# EAGLE schematic voodoo_dido (EAGLE 7.7.0)
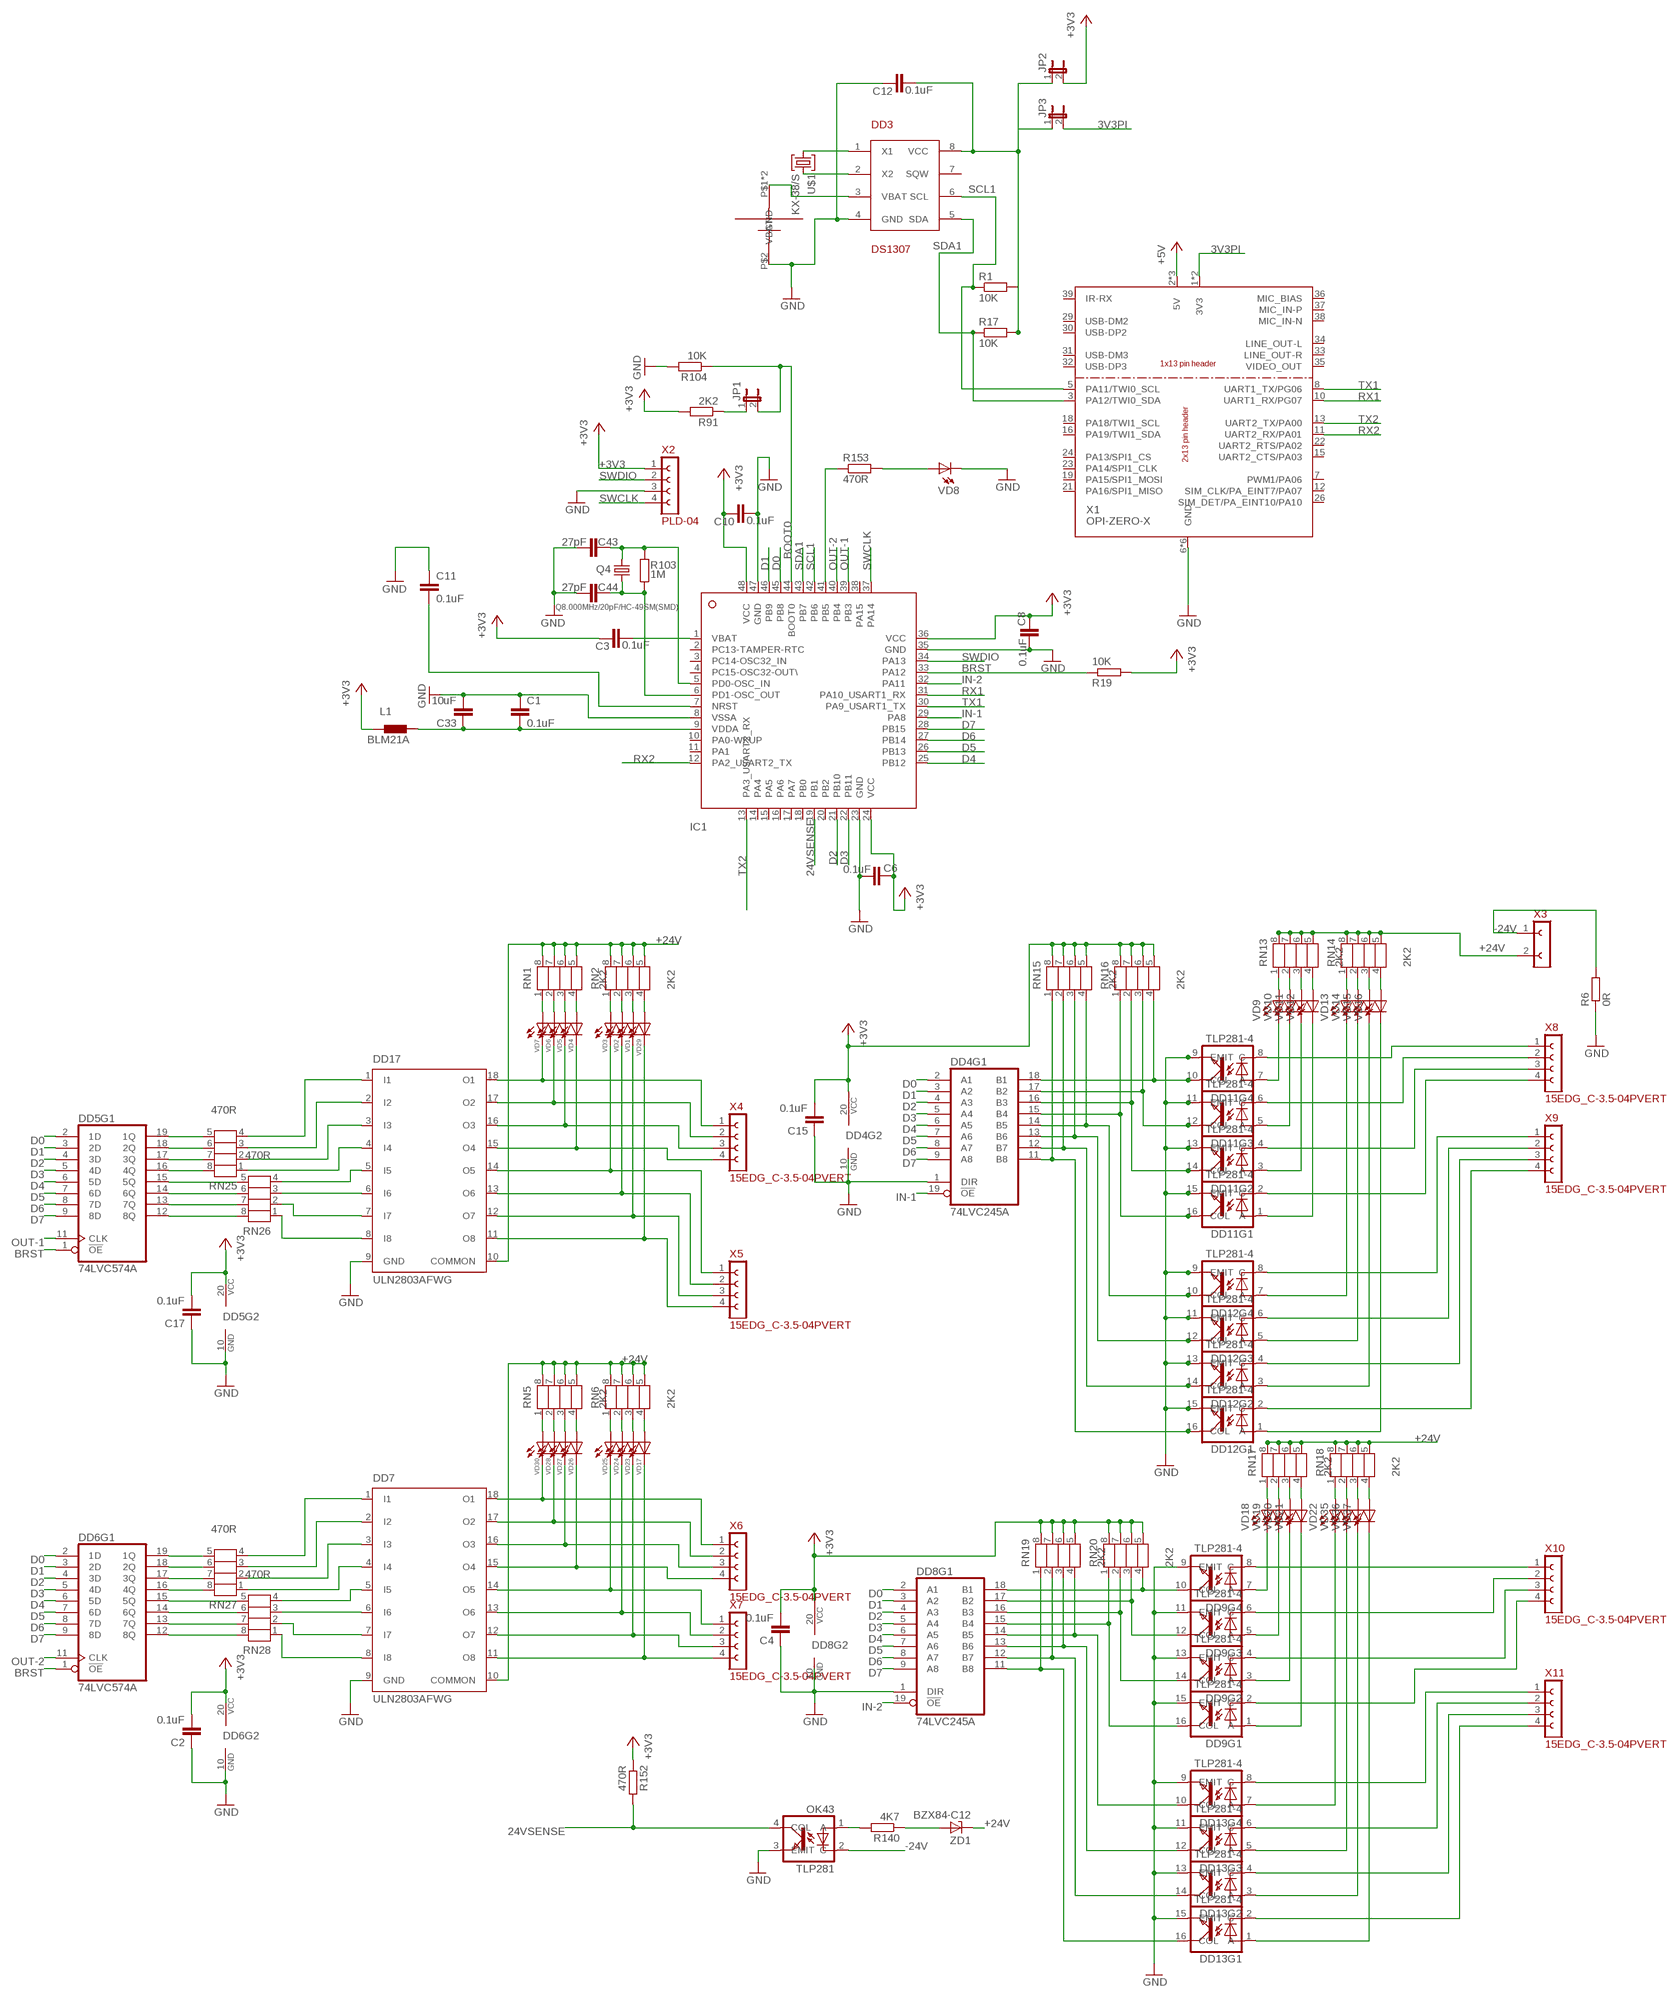
[diagram p0: schematic, sheet 1, part 1 of 2]
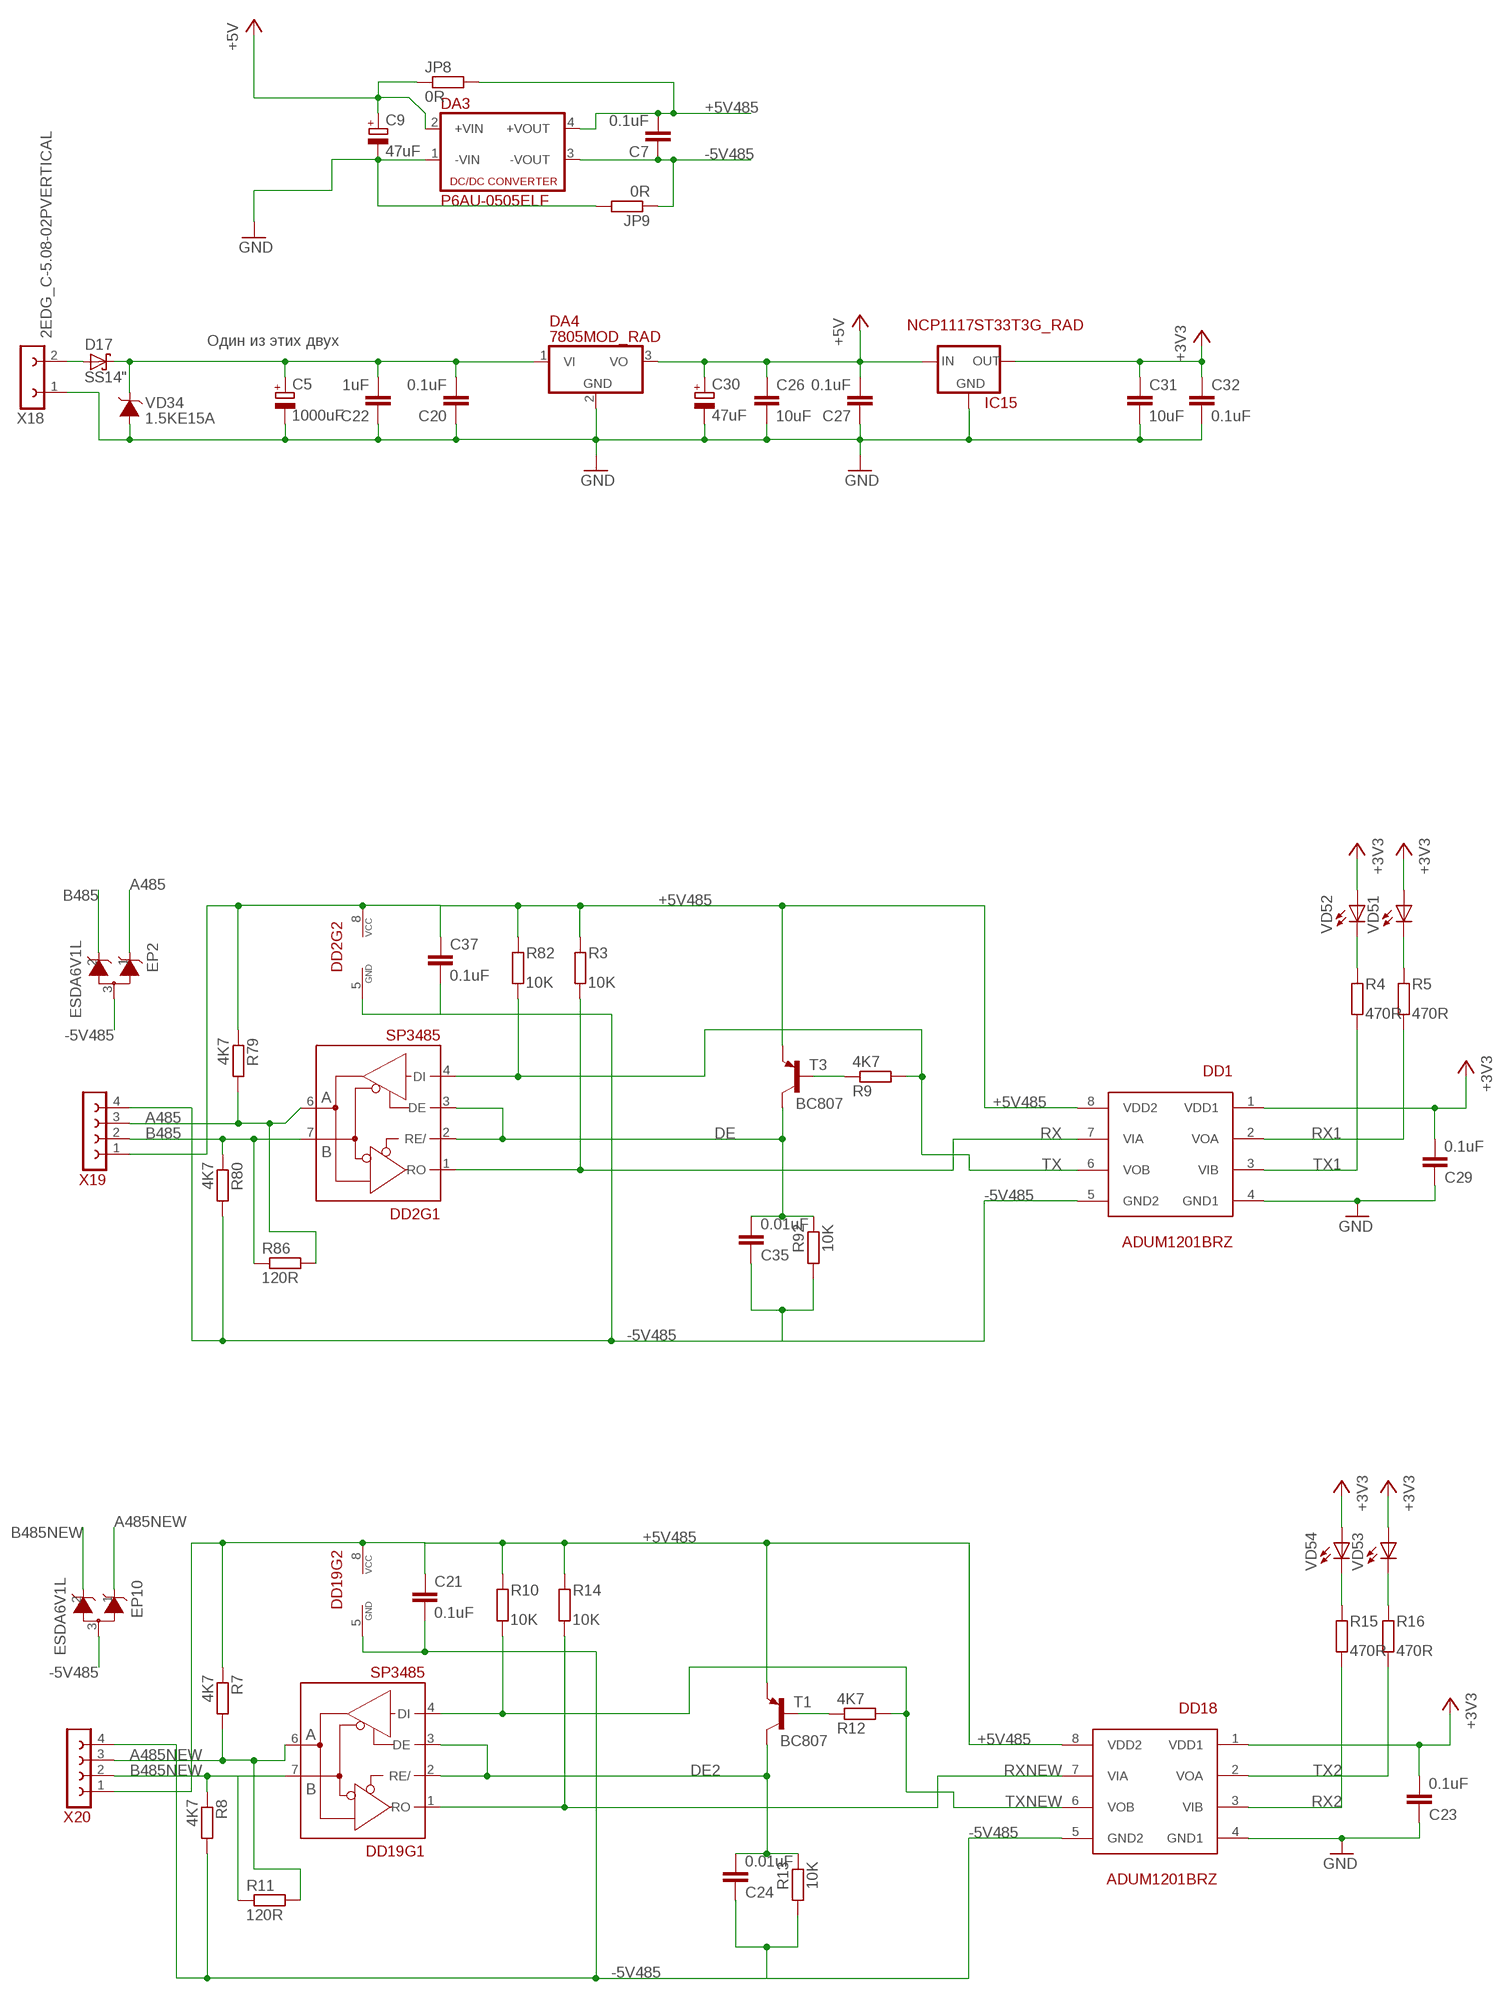
[diagram p1: schematic, sheet 1, part 2 of 2]

## Parts
B1  BH840  [BH840]
C1  0.1uF  CAP0603MOD  [0603MOD]
C2  0.1uF  CAP0805MOD  [0805MOD]
C3  0.1uF  CAP0603MOD  [0603MOD]
C4  0.1uF  CAP0805MOD  [0805MOD]
C5  1000uF  CPOL-EU150CLZ-1010  [150CLZ-1010]
C6  0.1uF  CAP0603MOD  [0603MOD]
C7  0.1uF  CAP0805MOD  [0805MOD]
C8  0.1uF  CAP0603MOD  [0603MOD]
C9  47uF  CPOL-EUSMCB  [SMC_B]
C10  0.1uF  CAP0603MOD  [0603MOD]
C11  0.1uF  CAP0603MOD  [0603MOD]
C12  0.1uF  CAP0603MOD  [0603MOD]
C15  0.1uF  CAP0805MOD  [0805MOD]
C17  0.1uF  CAP0805MOD  [0805MOD]
C20  0.1uF  CAP0805MOD  [0805MOD]
C21  0.1uF  CAP0805MOD  [0805MOD]
C22  1uF  CAP0805MOD  [0805MOD]
C23  0.1uF  CAP0805MOD  [0805MOD]
C24  0.01uF  CAP0805MOD  [0805MOD]
C26  10uF  C-EUC1206  [C1206]
C27  0.1uF  CAP0805MOD  [0805MOD]
C29  0.1uF  CAP0805MOD  [0805MOD]
C30  47uF  CPOL-EUSMCB  [SMC_B]
C31  10uF  C-EUC1206  [C1206]
C32  0.1uF  CAP0805MOD  [0805MOD]
C33  10uF  C-EUC1206  [C1206]
C35  0.01uF  CAP0805MOD  [0805MOD]
C37  0.1uF  CAP0805MOD  [0805MOD]
C43  27pF  CAP0805MOD  [0805MOD]
C44  27pF  CAP0805MOD  [0805MOD]
D17  SS14"  [MLL-41]
DA3  P6AU-0505ELF  [SIP4]
DA4  7805MOD_RAD  [TO220RAD]
DD1  ADUM1201BRZ  [SO08]
DD2  SP3485  [SO08]
DD3  DS1307  [SO08]
DD4  74LVC245A  [SO20W]
DD5  74LVC574A  [SO20W]
DD6  74LVC574A  [SO20W]
DD7  ULN2803AFWG  [SO18]
DD8  74LVC245A  [SO20W]
DD9  TLP281-4  [TLP281-4]
DD11  TLP281-4  [TLP281-4]
DD12  TLP281-4  [TLP281-4]
DD13  TLP281-4  [TLP281-4]
DD17  ULN2803AFWG  [SO18]
DD18  ADUM1201BRZ  [SO08]
DD19  SP3485  [SO08]
EP2  ESDA6V1L  [SOT23]
EP10  ESDA6V1L  [SOT23]
IC1  STM32F103C8T6  [TQFP48]
IC15  NCP1117ST33T3G_RAD  [SOT223_PCBRAD]
JP1  JP1E  [JP1]
JP2  JP1E  [JP1]
JP3  JP1E  [JP1]
JP8  0R  RES0805MOD  [0805MOD]
JP9  0R  RES0805MOD  [0805MOD]
L1  BLM21A  [1206/0603]
OK43  TLP281  [TLP281]
Q4  Q8.000MHz/20pF/HC-49SM(SMD)  CRYSTALHC49UP  [HC49UP]
R1  10K  RES0805MOD  [0805MOD]
R3  10K  RES0805MOD  [0805MOD]
R4  470R  RES0805MOD  [0805MOD]
R5  470R  RES0805MOD  [0805MOD]
R6  0R  RES0805MOD  [0805MOD]
R7  4K7  RES0805MOD  [0805MOD]
R8  4K7  RES0805MOD  [0805MOD]
R9  4K7  RES0805MOD  [0805MOD]
R10  10K  RES0805MOD  [0805MOD]
R11  120R  RES0805MOD  [0805MOD]
R12  4K7  RES0805MOD  [0805MOD]
R13  10K  RES0805MOD  [0805MOD]
R14  10K  RES0805MOD  [0805MOD]
R15  470R  RES0805MOD  [0805MOD]
R16  470R  RES0805MOD  [0805MOD]
R17  10K  RES0805MOD  [0805MOD]
R19  10K  RES0805MOD  [0805MOD]
R79  4K7  RES0805MOD  [0805MOD]
R80  4K7  RES0805MOD  [0805MOD]
R82  10K  RES0805MOD  [0805MOD]
R86  120R  RES0805MOD  [0805MOD]
R91  2K2  RES0805MOD  [0805MOD]
R92  10K  RES0805MOD  [0805MOD]
R103  1M  RES0805MOD  [0805MOD]
R104  10K  RES0805MOD  [0805MOD]
R140  4K7  RES0805MOD  [0805MOD]
R152  470R  RES0805MOD  [0805MOD]
R153  470R  RES0805MOD  [0805MOD]
RN1  2K2  CAT16-J4  [CAT16-J4]
RN2  2K2  CAT16-J4  [CAT16-J4]
RN5  2K2  CAT16-J4  [CAT16-J4]
RN6  2K2  CAT16-J4  [CAT16-J4]
RN13  2K2  CAT16-J4  [CAT16-J4]
RN14  2K2  CAT16-J4  [CAT16-J4]
RN15  2K2  CAT16-J4  [CAT16-J4]
RN16  2K2  CAT16-J4  [CAT16-J4]
RN17  2K2  CAT16-J4  [CAT16-J4]
RN18  2K2  CAT16-J4  [CAT16-J4]
RN19  2K2  CAT16-J4  [CAT16-J4]
RN20  2K2  CAT16-J4  [CAT16-J4]
RN25  470R  CAT16-J4  [CAT16-J4]
RN26  470R  CAT16-J4  [CAT16-J4]
RN27  470R  CAT16-J4  [CAT16-J4]
RN28  470R  CAT16-J4  [CAT16-J4]
T1  BC807  BC807-16-PNP-SOT23-BEC  [SOT23-BEC]
T3  BC807  BC807-16-PNP-SOT23-BEC  [SOT23-BEC]
U$1  KX-38/S  [KX-38]
VD1  KP-2012EC(RED)  [CHIP-LED0805]
VD2  KP-2012EC(RED)  [CHIP-LED0805]
VD3  KP-2012EC(RED)  [CHIP-LED0805]
VD4  KP-2012EC(RED)  [CHIP-LED0805]
VD5  KP-2012EC(RED)  [CHIP-LED0805]
VD6  KP-2012EC(RED)  [CHIP-LED0805]
VD7  KP-2012EC(RED)  [CHIP-LED0805]
VD8  KP-2012SGC(GREEN)  [CHIP-LED0805]
VD9  KP-2012SGC(GREEN)  [CHIP-LED0805]
VD10  KP-2012SGC(GREEN)  [CHIP-LED0805]
VD11  KP-2012SGC(GREEN)  [CHIP-LED0805]
VD12  KP-2012SGC(GREEN)  [CHIP-LED0805]
VD13  KP-2012SGC(GREEN)  [CHIP-LED0805]
VD14  KP-2012SGC(GREEN)  [CHIP-LED0805]
VD15  KP-2012SGC(GREEN)  [CHIP-LED0805]
VD16  KP-2012SGC(GREEN)  [CHIP-LED0805]
VD17  KP-2012EC(RED)  [CHIP-LED0805]
VD18  KP-2012SGC(GREEN)  [CHIP-LED0805]
VD19  KP-2012SGC(GREEN)  [CHIP-LED0805]
VD20  KP-2012SGC(GREEN)  [CHIP-LED0805]
VD21  KP-2012SGC(GREEN)  [CHIP-LED0805]
VD22  KP-2012SGC(GREEN)  [CHIP-LED0805]
VD23  KP-2012EC(RED)  [CHIP-LED0805]
VD24  KP-2012EC(RED)  [CHIP-LED0805]
VD25  KP-2012EC(RED)  [CHIP-LED0805]
VD26  KP-2012EC(RED)  [CHIP-LED0805]
VD27  KP-2012EC(RED)  [CHIP-LED0805]
VD28  KP-2012EC(RED)  [CHIP-LED0805]
VD29  KP-2012EC(RED)  [CHIP-LED0805]
VD30  KP-2012EC(RED)  [CHIP-LED0805]
VD34  1.5KE15A  [MSORB_41A-04_D]
VD35  KP-2012SGC(GREEN)  [CHIP-LED0805]
VD36  KP-2012SGC(GREEN)  [CHIP-LED0805]
VD37  KP-2012SGC(GREEN)  [CHIP-LED0805]
VD51  KP-2012SGC(GREEN)  [CHIP-LED0805]
VD52  KP-2012SGC(GREEN)  [CHIP-LED0805]
VD53  KP-2012SGC(GREEN)  [CHIP-LED0805]
VD54  KP-2012SGC(GREEN)  [CHIP-LED0805]
X1  OPI-ZERO-X  [OPI0X]
X2  PLD-04  [PLD04]
X3  2EDG_C-5.08-02PVERTICAL  [2EDGVC-5.08-02P]
X4  15EDG_C-3.5-04PVERT  [15EDGVC-3.5-04P]
X5  15EDG_C-3.5-04PVERT  [15EDGVC-3.5-04P]
X6  15EDG_C-3.5-04PVERT  [15EDGVC-3.5-04P]
X7  15EDG_C-3.5-04PVERT  [15EDGVC-3.5-04P]
X8  15EDG_C-3.5-04PVERT  [15EDGVC-3.5-04P]
X9  15EDG_C-3.5-04PVERT  [15EDGVC-3.5-04P]
X10  15EDG_C-3.5-04PVERT  [15EDGVC-3.5-04P]
X11  15EDG_C-3.5-04PVERT  [15EDGVC-3.5-04P]
X18  2EDG_C-5.08-02PVERTICAL  [2EDGVC-5.08-02P]
X19  15EDG_C-3.5-04PVERT  [15EDGVC-3.5-04P]
X20  15EDG_C-3.5-04PVERT  [15EDGVC-3.5-04P]
ZD1  BZX84-C12  [SOT23]

## Nets
3V3PI: JP3.2 X1.1(3V3) X1.17(3V3)
24VSENSE: IC1.19(PB1) OK43.4(COL) R152.P$2
+3V3: C2.P$2 C3.1 C4.P$2 C6.1 C8.1 C10.1 C15.P$2 C17.P$2 C23.P$2 C29.P$2 C31.1 C32.P$1 DD1.1(VDD1) DD4.20(VCC) DD5.20(VCC) DD6.20(VCC) DD8.20(VCC) DD18.1(VDD1) IC1.24(VDD) IC1.36(VDD) IC1.48(VDD) IC15.2(OUT) JP2.2 L1.1 R19.P$2 R91.P$2 R152.P$1 RN15.5 RN15.6 RN15.7 RN15.8 RN16.5 RN16.6 RN16.7 RN16.8 RN19.5 RN19.6 RN19.7 RN19.8 RN20.5 RN20.6 RN20.7 RN20.8 VD51.A VD52.A VD53.A VD54.A X2.1
+5V: C9.+ C26.1 C27.P$2 C30.+ DA3.2(+VIN) DA4.3(VO) IC15.3(IN) JP8.P$1 X1.2(5V) X1.4(5V) X1.27(5V)
+5V485: C7.P$2 C21.P$1 C37.P$1 DA3.4(+VOUT) DD1.8(VDD2) DD2.8(VCC) DD18.8(VDD2) DD19.8(VCC) JP8.P$2 R3.P$1 R7.P$1 R10.P$1 R14.P$1 R79.P$1 R82.P$1 T1.E T3.E X19.1 X20.1
+24V: DD7.10(COMMON) DD17.10(COMMON) RN1.5 RN1.6 RN1.7 RN1.8 RN2.5 RN2.6 RN2.7 RN2.8 RN5.5 RN5.6 RN5.7 RN5.8 RN6.5 RN6.6 RN6.7 RN6.8 RN13.5 RN13.6 RN13.7 RN13.8 RN14.5 RN14.6 RN14.7 RN14.8 RN17.5 RN17.6 RN17.7 RN17.8 RN18.5 RN18.6 RN18.7 RN18.8 X3.2 ZD1.3(C)
-5V485: C7.P$1 C21.P$2 C24.P$1 C35.P$1 C37.P$2 DA3.3(-VOUT) DD1.5(GND2) DD2.5(GND) DD18.5(GND2) DD19.5(GND) EP2.3 EP10.3 JP9.P$1 R8.P$2 R13.P$2 R80.P$2 R92.P$2 X19.4 X20.4
-24V: OK43.2(C) R6.P$2 X3.1
A485: DD2.6(A) EP2.1 R79.P$2 R86.P$2 X19.3
A485NEW: DD19.6(A) EP10.1 R7.P$2 R11.P$2 X20.3
B485: DD2.7(B) EP2.2 R80.P$1 R86.P$1 X19.2
B485NEW: DD19.7(B) EP10.2 R8.P$1 R11.P$1 X20.2
BOOT0: IC1.44(BOOT0) JP1.2 R104.P$1
BRST: DD5.1(!OE) DD6.1(!OE) IC1.33(PA12) R19.P$1
D0: DD4.2(A1) DD5.2(1D) DD6.2(1D) DD8.2(A1) IC1.45(PB8)
D1: DD4.3(A2) DD5.3(2D) DD6.3(2D) DD8.3(A2) IC1.46(PB9)
D2: DD4.4(A3) DD5.4(3D) DD6.4(3D) DD8.4(A3) IC1.21(PB10)
D3: DD4.5(A4) DD5.5(4D) DD6.5(4D) DD8.5(A4) IC1.22(PB11)
D4: DD4.6(A5) DD5.6(5D) DD6.6(5D) DD8.6(A5) IC1.25(PB12)
D5: DD4.7(A6) DD5.7(6D) DD6.7(6D) DD8.7(A6) IC1.26(PB13)
D6: DD4.8(A7) DD5.8(7D) DD6.8(7D) DD8.8(A7) IC1.27(PB14)
D7: DD4.9(A8) DD5.9(8D) DD6.9(8D) DD8.9(A8) IC1.28(PB15)
DE: C35.P$2 DD2.2(RE/) DD2.3(DE) R92.P$1 T3.C
DE2: C24.P$2 DD19.2(RE/) DD19.3(DE) R13.P$1 T1.C
GND: B1.P$2(GND) C1.1 C2.P$1 C4.P$1 C5.- C6.2 C8.2 C9.- C10.2 C11.1 C12.1 C15.P$1 C17.P$1 C20.P$1 C22.P$1 C23.P$1 C26.2 C27.P$1 C29.P$1 C30.- C31.2 C32.P$2 C33.2 C43.P$2 C44.P$2 DA3.1(-VIN) DA4.2(GND) DD1.4(GND1) DD3.4(GND) DD4.1(DIR) DD4.10(GND) DD5.10(GND) DD6.10(GND) DD7.9(GND) DD8.1(DIR) DD8.10(GND) DD9.9(EMIT) DD9.11(EMIT) DD9.13(EMIT) DD9.15(EMIT) DD11.9(EMIT) DD11.11(EMIT) DD11.13(EMIT) DD11.15(EMIT) DD12.9(EMIT) DD12.11(EMIT) DD12.13(EMIT) DD12.15(EMIT) DD13.9(EMIT) DD13.11(EMIT) DD13.13(EMIT) DD13.15(EMIT) DD17.9(GND) DD18.4(GND1) IC1.8(VSSA) IC1.23(VSS) IC1.35(VSS) IC1.47(VSS) IC15.1(GND) JP9.P$2 OK43.3(EMIT) R6.P$1 R104.P$2 VD8.C VD34.A X1.6(GND) X1.9(GND) X1.14(GND) X1.20(GND) X1.25(GND) X1.28(GND) X2.3 X18.1
IN-1: DD4.19(!OE) IC1.29(PA8)
IN-2: DD8.19(!OE) IC1.32(PA11)
N$1: DD8.18(B1) DD9.10(COL) RN20.4
N$2: DD11.7(A) VD9.C
N$3: C5.+ C20.P$2 C22.P$2 D17.K(C) DA4.1(VI) VD34.С(C)
N$4: R4.P$1 VD52.C
N$5: R5.P$1 VD51.C
N$6: IC1.41(PB5) R153.P$1
N$7: DD8.17(B2) DD9.12(COL) RN20.3
N$8: C11.2 IC1.7(NRST)
N$9: DD8.16(B3) DD9.14(COL) RN20.2
N$10: D17.A X18.2
N$12: DD3.1(X1) U$1.1
N$13: DD8.15(B4) DD9.16(COL) RN20.1
N$14: DD9.7(A) VD18.C
N$15: DD9.5(A) VD19.C
N$16: DD3.2(X2) U$1.2
N$17: B1.P$1(VBAT) B1.P$3(VBAT) DD3.3(VBAT)
N$18: C12.2 DD3.8(VCC) JP2.1 JP3.1 R1.P$2 R17.P$2
N$19: C3.2 IC1.1(VBAT)
N$21: DD9.3(A) VD20.C
N$22: DD11.5(A) VD10.C
N$23: DD11.3(A) VD11.C
N$24: DD4.18(B1) DD11.10(COL) RN16.4
N$26: DD11.1(A) VD12.C
N$27: RN13.1 VD9.A
N$28: RN13.2 VD10.A
N$29: RN13.3 VD11.A
N$30: DD4.14(B5) DD12.10(COL) RN15.4
N$31: DD4.13(B6) DD12.12(COL) RN15.3
N$32: DD4.12(B7) DD12.14(COL) RN15.2
N$33: RN13.4 VD12.A
N$34: RN14.1 VD13.A
N$35: RN14.2 VD14.A
N$36: RN14.3 VD15.A
N$37: RN14.4 VD16.A
N$38: DD12.8(C) X9.1
N$39: DD12.6(C) X9.2
N$40: DD4.11(B8) DD12.16(COL) RN15.1
N$41: DD12.4(C) X9.3
N$42: DD12.2(C) X9.4
N$43: DD9.1(A) VD21.C
N$44: DD12.7(A) VD13.C
N$45: DD12.5(A) VD14.C
N$46: DD12.3(A) VD15.C
N$47: DD12.1(A) VD16.C
N$48: DD11.8(C) X8.1
N$49: RN17.1 VD18.A
N$50: DD4.17(B2) DD11.12(COL) RN16.3
N$51: DD4.16(B3) DD11.14(COL) RN16.2
N$52: DD4.15(B4) DD11.16(COL) RN16.1
N$53: DD11.6(C) X8.2
N$54: DD11.4(C) X8.3
N$55: DD11.2(C) X8.4
N$56: RN17.2 VD19.A
N$57: RN17.3 VD20.A
N$58: RN17.4 VD21.A
N$59: RN18.1 VD22.A
N$60: RN18.2 VD35.A
N$61: RN18.3 VD36.A
N$62: RN18.4 VD37.A
N$63: DD13.8(C) X11.1
N$64: DD13.6(C) X11.2
N$65: DD13.4(C) X11.3
N$66: DD13.2(C) X11.4
N$67: DD13.7(A) VD22.C
N$68: DD13.5(A) VD35.C
N$69: DD13.3(A) VD36.C
N$70: DD13.1(A) VD37.C
N$71: DD9.8(C) X10.1
N$72: DD9.6(C) X10.2
N$73: DD9.4(C) X10.3
N$74: DD9.2(C) X10.4
N$75: DD8.14(B5) DD13.10(COL) RN19.4
N$76: DD8.13(B6) DD13.12(COL) RN19.3
N$77: DD8.12(B7) DD13.14(COL) RN19.2
N$78: DD8.11(B8) DD13.16(COL) RN19.1
N$88: DD5.19(1Q) RN25.5
N$89: DD17.8(I8) RN26.1
N$90: DD17.7(I7) RN26.2
N$91: DD17.6(I6) RN26.3
N$92: DD17.5(I5) RN26.4
N$93: C1.2 C33.1 IC1.9(VDDA) L1.2
N$94: DD17.4(I4) RN25.1
N$95: DD17.3(I3) RN25.2
N$96: DD17.2(I2) RN25.3
N$98: R9.P$1 T3.B
N$99: DD17.1(I1) RN25.4
N$100: R153.P$2 VD8.A
N$101: R12.P$1 T1.B
N$102: R140.P$1 ZD1.1(A)
N$103: JP1.1 R91.P$1
N$104: R15.P$1 VD54.C
N$105: R16.P$1 VD53.C
N$106: OK43.1(A) R140.P$2
N$108: DD5.15(5Q) RN26.5
N$110: DD6.19(1Q) RN27.5
N$111: DD5.18(2Q) RN25.6
N$112: DD5.17(3Q) RN25.7
N$113: DD5.16(4Q) RN25.8
N$115: DD5.14(6Q) RN26.6
N$116: DD6.18(2Q) RN27.6
N$117: DD6.17(3Q) RN27.7
N$118: DD6.16(4Q) RN27.8
N$119: DD6.15(5Q) RN28.5
N$124: DD17.18(O1) VD7.C X4.1
N$126: DD17.17(O2) VD6.C X4.2
N$128: DD17.16(O3) VD5.C X4.3
N$129: DD17.15(O4) VD4.C X4.4
N$131: DD6.14(6Q) RN28.6
N$132: DD6.13(7Q) RN28.7
N$133: DD6.12(8Q) RN28.8
N$134: DD7.8(I8) RN28.1
N$135: DD7.7(I7) RN28.2
N$140: DD7.6(I6) RN28.3
N$142: DD7.5(I5) RN28.4
N$144: DD7.4(I4) RN27.1
N$145: DD17.14(O5) VD3.C X5.1
N$146: DD17.13(O6) VD2.C X5.2
N$147: DD7.3(I3) RN27.2
N$148: RN1.1 VD7.A
N$149: DD7.2(I2) RN27.3
N$150: DD7.1(I1) RN27.4
N$153: DD17.12(O7) VD1.C X5.3
N$154: DD17.11(O8) VD29.C X5.4
N$157: DD5.13(7Q) RN26.7
N$158: RN1.2 VD6.A
N$159: DD5.12(8Q) RN26.8
N$163: RN1.3 VD5.A
N$164: DD7.18(O1) VD30.C X6.1
N$165: RN1.4 VD4.A
N$166: DD7.17(O2) VD28.C X6.2
N$167: RN2.1 VD3.A
N$168: DD7.16(O3) VD27.C X6.3
N$169: DD7.15(O4) VD26.C X6.4
N$170: DD7.14(O5) VD25.C X7.1
N$171: DD7.13(O6) VD24.C X7.2
N$172: DD7.12(O7) VD23.C X7.3
N$173: RN2.2 VD2.A
N$174: RN2.3 VD1.A
N$175: RN2.4 VD29.A
N$178: C43.P$1 IC1.5(PD0-OSC_IN) Q4.2 R103.P$2
N$179: C44.P$1 IC1.6(PD1-OSC_OUT) Q4.1 R103.P$1
N$187: DD7.11(O8) VD17.C X7.4
N$188: RN5.1 VD30.A
N$189: RN5.2 VD28.A
N$190: RN5.3 VD27.A
N$191: RN5.4 VD26.A
N$192: RN6.1 VD25.A
N$193: RN6.2 VD24.A
N$194: RN6.3 VD23.A
N$195: RN6.4 VD17.A
OUT-1: DD5.11(CLK) IC1.39(PB3)
OUT-2: DD6.11(CLK) IC1.40(PB4)
RX: DD1.7(VIA) DD2.1(RO) R3.P$2
RX1: DD1.2(VOA) IC1.31(PA10_USART1_RX) R5.P$2 X1.10(UART1_RX/PG07)
RX2: DD18.2(VOA) IC1.12(PA2_USART2_TX) R16.P$2 X1.11(UART2_RX/PA01)
RXNEW: DD18.7(VIA) DD19.1(RO) R14.P$2
SCL1: DD3.6(SCL) IC1.42(PB6) R1.P$1 X1.5(PA11/TWI0_SCL)
SDA1: DD3.5(SDA) IC1.43(PB7) R17.P$1 X1.3(PA12/TWI0_SDA)
SWCLK: IC1.37(PA14) X2.4
SWDIO: IC1.34(PA13) X2.2
TX: DD1.6(VOB) DD2.4(DI) R9.P$2 R82.P$2
TX1: DD1.3(VIB) IC1.30(PA9_USART1_TX) R4.P$2 X1.8(UART1_TX/PG06)
TX2: DD18.3(VIB) IC1.13(PA3_USART2_RX) R15.P$2 X1.13(UART2_TX/PA00)
TXNEW: DD18.6(VOB) DD19.4(DI) R10.P$2 R12.P$2
Unconnected: DD3.7(SQW) IC1.2(PC13-TAMPER-RTC) IC1.3(PC14-OSC32_IN) IC1.4(PC15-OSC32-OUT\) IC1.10(PA0-WKUP) IC1.11(PA1) IC1.14(PA4) IC1.15(PA5) IC1.16(PA6) IC1.18(PB0) IC1.20(PB2) IC1.38(PA15) X1.7(PWM1/PA06) X1.12(SIM_CLK/PA_EINT7/PA07) X1.15(UART2_CTS/PA03) X1.16(PA19/TWI1_SDA) X1.18(PA18/TWI1_SCL) X1.19(PA15/SPI1_MOSI) X1.21(PA16/SPI1_MISO) X1.22(UART2_RTS/PA02) X1.23(PA14/SPI1_CLK) X1.24(PA13/SPI1_CS) X1.26(SIM_DET/PA_EINT10/PA10) X1.29(USB-DM2) X1.30(USB-DP2) X1.31(USB-DM3) X1.32(USB-DP3) X1.33(LINE_OUT-R) X1.34(LINE_OUT-L) X1.35(VIDEO_OUT) X1.36(MIC_BIAS) X1.37(MIC_IN-P) X1.38(MIC_IN-N) X1.39(IR-RX)

## Notes on the sheet
- Один из этих двух

## Power pins joined to a net without a drawn wire
PA7: IC1.17(PA7)

## Library data of the parts
B1 = 1my_components:BH840
C1 C3 C6 C8 C10-C12 = growbot:CAP0603MOD
C2 C4 C7 C15 C17 C20-C24 C27 C29 C32 C35 C37 C43 C44 = growbot:CAP0805MOD
C5 C9 C30 = rcl:CPOL-EU: POLARIZED CAPACITOR, European symbol
C26 C31 C33 = rcl:C-EU: CAPACITOR, European symbol
D17 = growbot:SS14
DA3 = doz:P6AU-0505ELF
DA4 = doz:7805MOD_RAD
DD1 DD18 = doz:ADUM1201BRZ
DD2 DD19 = doz:SP3485
DD3 = mylib:DS1307
DD4 DD8 = doz:74LVC245A
DD5 DD6 = doz:74LVC574A
DD7 DD17 = doz:ULN2803
DD9 DD11-DD13 = doz:TLP281-4
EP2 EP10 = growbot:ESDA6V1L: 2 channel 5v esd protection
IC1 = perehodnik:STM32F103C8T6: STM32
IC15 = perehodnik:NCP1117ST33T3G
JP1-JP3 = jumper:JP1E: JUMPER
JP8 JP9 R1 R3-R17 R19 R79 R80 R82 R86 R91 R92 R103 R104 R140 R152 R153 = growbot:RES0805MOD
L1 = doz:BLM21A: EMI Filter
OK43 = doz:TLP281: Small optocoupler
Q4 = crystal:CRYSTAL: CRYSTAL; OC_FARNELL: unknown; OC_NEWARK: unknown
RN1 RN2 RN5 RN6 RN13-RN20 RN25-RN28 = doz:CAT16-J4
T1 T3 = transistor:*-PNP-: PNP Transistror
U$1 = doz:KX-: clock crystal
VD1-VD30 VD35-VD37 VD51-VD54 = doz:KP-2012: 0805 led. smaller/bigger counts too
VD34 = gazves:1.5KE15A: TVS Supressor 12V
X1 = OrangePi0:OPI-ZERO-X
X2 = growbot:PLD-04
X3 X18 = doz:2EDG_C-5.08-02P
X4-X11 X19 X20 = doz:15EDG_C-3.5-04P: pluggable switch 3.5
ZD1 = doz:BZX84-C12: Стабилитрончик 0.25 вт 12В

## Net classes
0 default: width 0.2 mm, drill 0.4 mm, clearance 0.2 mm